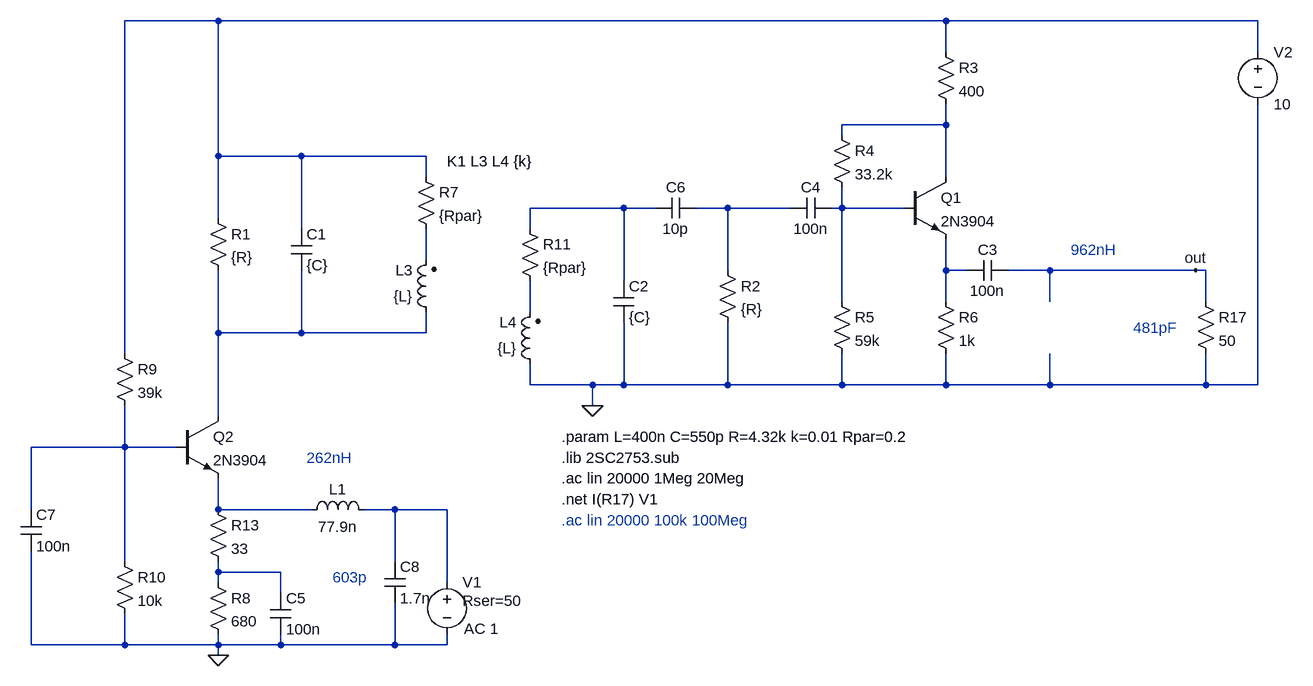
[diagram p0: schematic filter.asc]
filter.asc, the LTspice schematic file:
Version 4
SHEET 1 2536 820
WIRE 256 -176 112 -176
WIRE 1376 -176 256 -176
WIRE 1856 -176 1376 -176
WIRE 1376 -128 1376 -176
WIRE 1856 -128 1856 -176
WIRE 1376 -16 1376 -48
WIRE 1376 -16 1216 -16
WIRE 1216 0 1216 -16
WIRE 256 32 256 -176
WIRE 384 32 256 32
WIRE 576 32 384 32
WIRE 576 64 576 32
WIRE 1376 64 1376 -16
WIRE 880 112 736 112
WIRE 928 112 880 112
WIRE 1040 112 992 112
WIRE 1136 112 1040 112
WIRE 1216 112 1216 80
WIRE 1216 112 1200 112
WIRE 1312 112 1216 112
WIRE 256 128 256 32
WIRE 384 144 384 32
WIRE 736 144 736 112
WIRE 576 192 576 144
WIRE 1040 208 1040 112
WIRE 1376 208 1376 160
WIRE 1408 208 1376 208
WIRE 1536 208 1472 208
WIRE 1760 208 1536 208
WIRE 1776 208 1760 208
WIRE 880 224 880 112
WIRE 1216 256 1216 112
WIRE 1376 256 1376 208
WIRE 1536 256 1536 208
WIRE 1776 256 1776 208
WIRE 736 272 736 224
WIRE 256 304 256 208
WIRE 384 304 384 208
WIRE 384 304 256 304
WIRE 576 304 576 272
WIRE 576 304 384 304
WIRE 112 336 112 -176
WIRE 736 384 736 352
WIRE 832 384 736 384
WIRE 880 384 880 288
WIRE 880 384 832 384
WIRE 1040 384 1040 288
WIRE 1040 384 880 384
WIRE 1216 384 1216 336
WIRE 1216 384 1040 384
WIRE 1376 384 1376 336
WIRE 1376 384 1216 384
WIRE 1536 384 1536 336
WIRE 1536 384 1376 384
WIRE 1776 384 1776 336
WIRE 1776 384 1536 384
WIRE 1856 384 1856 -48
WIRE 1856 384 1776 384
WIRE 832 416 832 384
WIRE 256 432 256 304
WIRE 112 480 112 416
WIRE 112 480 -32 480
WIRE 192 480 112 480
WIRE -32 576 -32 480
WIRE 256 576 256 528
WIRE 400 576 256 576
WIRE 528 576 480 576
WIRE 608 576 528 576
WIRE 112 656 112 480
WIRE 528 656 528 576
WIRE 256 672 256 656
WIRE 352 672 256 672
WIRE 256 688 256 672
WIRE 608 688 608 576
WIRE 352 704 352 672
WIRE -32 784 -32 640
WIRE 112 784 112 736
WIRE 112 784 -32 784
WIRE 256 784 256 768
WIRE 256 784 112 784
WIRE 352 784 352 768
WIRE 352 784 256 784
WIRE 528 784 528 720
WIRE 528 784 352 784
WIRE 608 784 608 768
WIRE 608 784 528 784
WIRE 256 800 256 784
FLAG 832 416 0
FLAG 1760 208 out
FLAG 256 800 0
SYMBOL res 240 112 R0
SYMATTR InstName R1
SYMATTR Value {R}
SYMBOL cap 368 144 R0
SYMATTR InstName C1
SYMATTR Value {C}
SYMBOL cap 864 224 R0
SYMATTR InstName C2
SYMATTR Value {C}
SYMBOL res 1024 192 R0
SYMATTR InstName R2
SYMATTR Value {R}
SYMBOL ind2 592 288 R180
WINDOW 0 36 80 Left 2
WINDOW 3 36 40 Left 2
SYMATTR InstName L3
SYMATTR Value {L}
SYMBOL ind2 752 368 R180
WINDOW 0 36 80 Left 2
WINDOW 3 36 40 Left 2
SYMATTR InstName L4
SYMATTR Value {L}
SYMBOL res 1200 -16 R0
SYMATTR InstName R4
SYMATTR Value 33.2k
SYMBOL res 1200 240 R0
SYMATTR InstName R5
SYMATTR Value 59k
SYMBOL res 1360 240 R0
SYMATTR InstName R6
SYMATTR Value 1k
SYMBOL voltage 1856 -144 R0
WINDOW 123 0 0 Left 0
WINDOW 39 0 0 Left 0
SYMATTR InstName V2
SYMATTR Value 10
SYMBOL cap 1472 192 R90
WINDOW 0 0 32 VBottom 2
WINDOW 3 32 32 VTop 2
SYMATTR InstName C3
SYMATTR Value 100n
SYMBOL res 1360 -144 R0
SYMATTR InstName R3
SYMATTR Value 400
SYMBOL npn 192 432 R0
SYMATTR InstName Q2
SYMATTR Value 2N3904
SYMBOL res 1760 240 R0
SYMATTR InstName R17
SYMATTR Value 50
SYMBOL voltage 608 672 R0
WINDOW 123 26 87 Left 2
WINDOW 39 24 44 Left 2
SYMATTR Value2 AC 1
SYMATTR SpiceLine Rser=50
SYMATTR InstName V1
SYMATTR Value ""
SYMBOL npn 1312 64 R0
SYMATTR InstName Q1
SYMATTR Value 2N3904
SYMBOL res 560 48 R0
SYMATTR InstName R7
SYMATTR Value {Rpar}
SYMBOL res 720 128 R0
SYMATTR InstName R11
SYMATTR Value {Rpar}
SYMBOL cap 1200 96 R90
WINDOW 0 0 32 VBottom 2
WINDOW 3 32 32 VTop 2
SYMATTR InstName C4
SYMATTR Value 100n
SYMBOL res 240 672 R0
SYMATTR InstName R8
SYMATTR Value 680
SYMBOL res 96 320 R0
SYMATTR InstName R9
SYMATTR Value 39k
SYMBOL res 96 640 R0
SYMATTR InstName R10
SYMATTR Value 10k
SYMBOL cap 336 704 R0
SYMATTR InstName C5
SYMATTR Value 100n
SYMBOL cap -48 576 R0
SYMATTR InstName C7
SYMATTR Value 100n
SYMBOL res 240 560 R0
SYMATTR InstName R13
SYMATTR Value 33
SYMBOL cap 992 96 R90
WINDOW 0 0 32 VBottom 2
WINDOW 3 32 32 VTop 2
SYMATTR InstName C6
SYMATTR Value 10p
SYMBOL cap 512 656 R0
SYMATTR InstName C8
SYMATTR Value 1.7n
SYMBOL ind 384 592 R270
WINDOW 0 32 56 VTop 2
WINDOW 3 5 56 VBottom 2
SYMATTR InstName L1
SYMATTR Value 77.9n
TEXT 608 40 Left 2 !K1 L3 L4 {k}
TEXT 784 528 Left 2 !.ac lin 20000 1Meg 20Meg
TEXT 784 496 Left 2 !.lib 2SC2753.sub
TEXT 784 464 Left 2 !.param L=400n C=550p R=4.32k k=0.01 Rpar=0.2
TEXT 784 560 Left 2 !.net I(R17) V1
TEXT 784 592 Left 2 ;.ac lin 20000 100k 100Meg
TEXT 392 496 Left 2 ;262nH
TEXT 432 680 Left 2 ;603p
TEXT 1568 176 Left 2 ;962nH
TEXT 1664 296 Left 2 ;481pF

The netlist it stands for:
* filter.asc
R1 N001 N009 {R}
C1 N001 N009 {C}
C2 N003 0 {C}
R2 N004 0 {R}
L3 N009 N006 {L}
L4 0 N008 {L}
R4 N002 N005 33.2k
R5 N005 0 59k
R6 N007 0 1k
V2 N001 0 10
C3 out N007 100n
R3 N001 N002 400
Q2 N009 N010 N011 0 2N3904
R17 out 0 50
V1 N012 0 AC 1 Rser=50
Q1 N002 N005 N007 0 2N3904
R7 N001 N006 {Rpar}
R11 N003 N008 {Rpar}
C4 N005 N004 100n
R8 N013 0 680
R9 N001 N010 39k
R10 N010 0 10k
C5 N013 0 100n
C7 N010 0 100n
R13 N011 N013 33
C6 N004 N003 10p
C8 N012 0 1.7n
L1 N011 N012 77.9n
.model NPN NPN
.model PNP PNP
.lib standard.bjt
K1 L3 L4 {k}
.ac lin 20000 1Meg 20Meg
.lib 2SC2753.sub
.param L=400n C=550p R=4.32k k=0.01 Rpar=0.2
.net I(R17) V1
* .ac lin 20000 100k 100Meg
* 262nH
* 603p
* 962nH
* 481pF
.backanno
.end